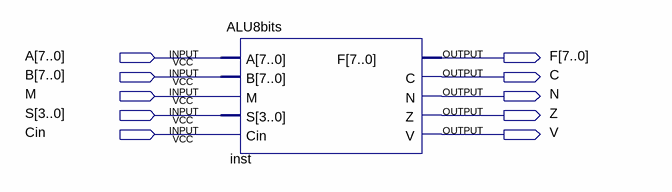
[diagram p0: schematic sheet]
// Quartus schematic testalu.bdf as structural Verilog: 1 symbols, 10 pins
module testalu (
  input  [7:0] A,
  input  [7:0] B,
  input  M,
  input  [3:0] S,
  input  Cin,
  output [7:0] F,
  output C,
  output N,
  output Z,
  output V
);

  ALU8bits inst (.A(A), .B(B), .M(M), .S(S), .Cin(Cin), .F(F), .C(C), .N(N), .Z(Z), .V(V));
endmodule
